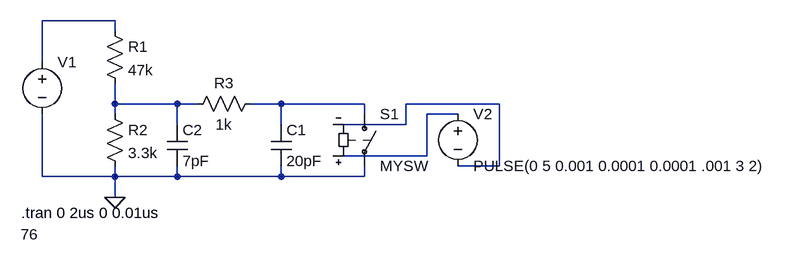
[diagram p0: schematic emonDC_ACDinput_LTSpice.asc]
emonDC_ACDinput_LTSpice.asc, the LTspice schematic file:
Version 4
SHEET 1 1204 680
WIRE 176 0 64 0
WIRE 176 16 176 0
WIRE 64 64 64 0
WIRE 176 128 176 96
WIRE 272 128 176 128
WIRE 304 128 272 128
WIRE 432 128 384 128
WIRE 560 128 432 128
WIRE 768 128 624 128
WIRE 176 144 176 128
WIRE 560 144 560 128
WIRE 704 144 656 144
WIRE 272 160 272 128
WIRE 432 160 432 128
WIRE 624 160 624 128
WIRE 624 160 512 160
WIRE 656 208 656 144
WIRE 656 208 512 208
WIRE 768 224 768 128
WIRE 768 224 704 224
WIRE 64 240 64 144
WIRE 176 240 176 224
WIRE 176 240 64 240
WIRE 272 240 272 224
WIRE 272 240 176 240
WIRE 432 240 432 224
WIRE 432 240 272 240
WIRE 560 240 560 224
WIRE 560 240 432 240
WIRE 176 272 176 240
FLAG 176 272 0
SYMBOL res 160 0 R0
SYMATTR InstName R1
SYMATTR Value 47k
SYMBOL res 160 128 R0
SYMATTR InstName R2
SYMATTR Value 3.3k
SYMBOL voltage 64 48 R0
WINDOW 3 -33 281 Left 2
WINDOW 123 0 0 Left 2
WINDOW 39 0 0 Left 2
SYMATTR Value 76
SYMATTR InstName V1
SYMBOL cap 416 160 R0
SYMATTR InstName C1
SYMATTR Value 20pF
SYMBOL res 400 112 R90
WINDOW 0 0 56 VBottom 2
WINDOW 3 32 56 VTop 2
SYMATTR InstName R3
SYMATTR Value 1k
SYMBOL cap 256 160 R0
SYMATTR InstName C2
SYMATTR Value 7pF
SYMBOL sw 560 128 R0
SYMATTR InstName S1
SYMATTR Value MYSW
SYMBOL voltage 704 128 R0
SYMATTR InstName V2
SYMATTR Value PULSE(0 5 0.001 0.0001 0.0001 .001 3 2)
TEXT 32 296 Left 2 !.tran 0 2us 0 0.01us

The netlist it stands for:
* emonDC_ACDinput_LTSpice.asc
R1 N001 N002 47k
R2 N002 0 3.3k
V1 N001 0 76
C1 N003 0 20pF
R3 N003 N002 1k
C2 N002 0 7pF
S1 N003 0 N005 N004 MYSW
V2 N005 N004 PULSE(0 5 0.001 0.0001 0.0001 .001 3 2)
.tran 0 2us 0 0.01us
.backanno
.end